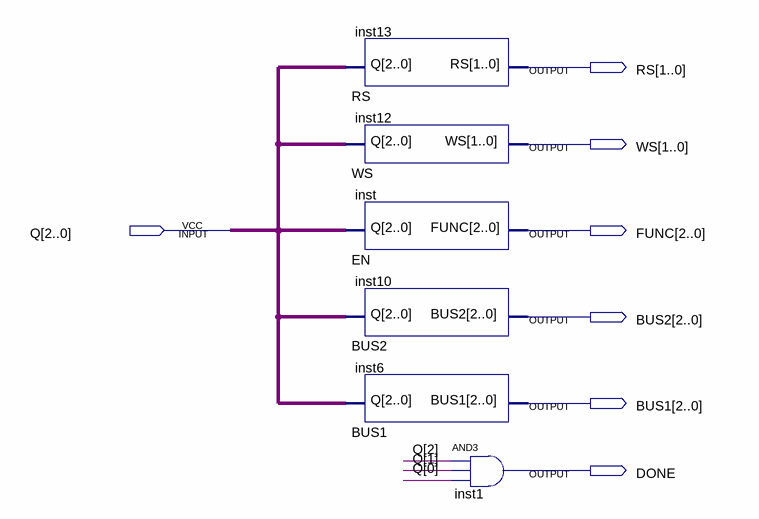
[diagram p0: schematic sheet]
// Quartus schematic OUTPUT_CONTROL.bdf as structural Verilog: 6 symbols, 7 pins
module OUTPUT_CONTROL (
  input  [2:0] Q,
  output [1:0] RS,
  output [1:0] WS,
  output [2:0] FUNC,
  output [2:0] BUS2,
  output [2:0] BUS1,
  output DONE
);

  RS inst13 (.Q(Q), .RS(RS));
  WS inst12 (.Q(Q), .WS(WS));
  EN inst (.Q(Q), .FUNC(FUNC));
  BUS2 inst10 (.Q(Q), .BUS2(BUS2));
  BUS1 inst6 (.Q(Q), .BUS1(BUS1));
  and inst1 (DONE, Q[2], Q[1], Q[0]);
endmodule
